# EAGLE design zero_board (EAGLE 6.4)
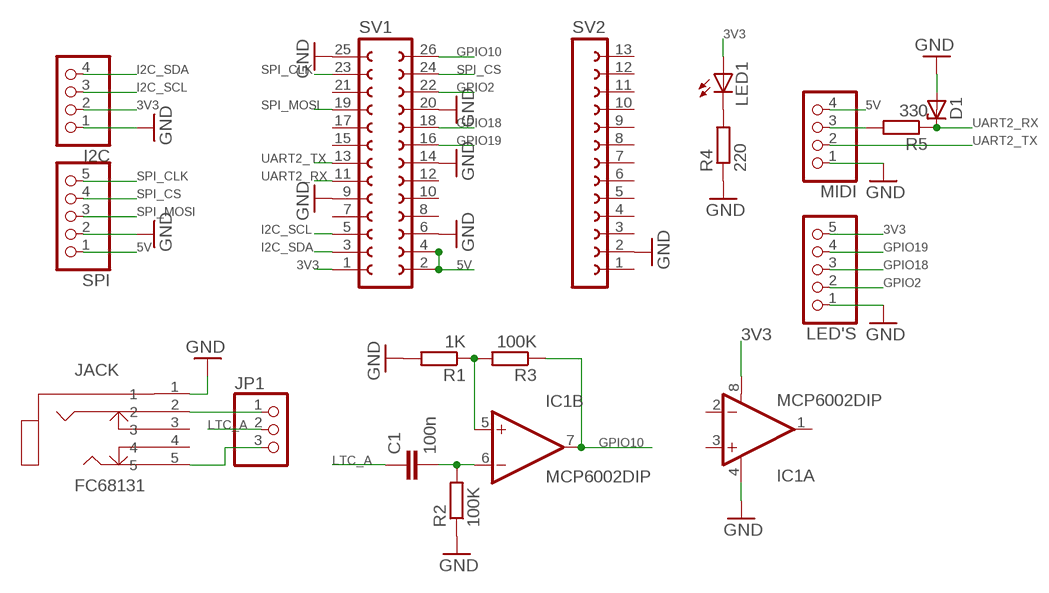
[diagram p0: schematic, sheet 1]

## Parts
C1  100n  C-EU050-024X044  [C050-024X044]
D1  ZENER-DIODEZD-2.5  [ZDIO-2.5]
I2C  PINHD-1X4  [1X04]
IC1  MCP6002DIP  [DIP08]
JACK  FC68131  [FC68131-5P]
JP1  PINHD-1X3  [1X03]
LED1  LED3MM  [LED3MM]
LED'S  PINHD-1X5  [1X05]
MIDI  PINHD-1X4  [1X04]
R1  1K  R-EU_0204/5  [0204/5]
R2  100K  R-EU_0204/5  [0204/5]
R3  100K  R-EU_0204/5  [0204/5]
R4  220  R-EU_0204/5  [0204/5]
R5  330  R-EU_0204/2V  [0204V]
SPI  PINHD-1X5  [1X05]
SV1  FE13-2  [FE13-2]
SV2  FE13-1  [FE13]

## Nets
3V3: I2C.2 IC1.8(A:V+) LED1.A LED'S.5 SV1.1
5V: MIDI.4 SPI.1 SV1.2 SV1.4
GND: D1.A I2C.1 IC1.4(A:V-) JACK.1 LED'S.1 MIDI.1 R1.2 R2.1 R4.1 SPI.2 SV1.6 SV1.9 SV1.14 SV1.20 SV1.25 SV2.2
GPIO2: LED'S.2 SV1.22
GPIO10: IC1.7(B:OUT) R3.1 SV1.26
GPIO18: LED'S.3 SV1.18
GPIO19: LED'S.4 SV1.16
I2C_SCL: I2C.3 SV1.5
I2C_SDA: I2C.4 SV1.3
LTC_A: C1.1 JP1.2
N$1: LED1.K(C) R4.2
N$2: JACK.5 JP1.3
N$3: JACK.2 JP1.1
N$5: C1.2 IC1.6(B:-IN) R2.2
N$6: IC1.5(B:+IN) R1.1 R3.2
N$7: MIDI.3 R5.2
SPI_CLK: SPI.5 SV1.23
SPI_CS: SPI.4 SV1.24
SPI_MOSI: SPI.3 SV1.19
UART2_RX: D1.C R5.1 SV1.11
UART2_TX: MIDI.2 SV1.13
Unconnected: IC1.1(A:OUT) IC1.2(A:-IN) IC1.3(A:+IN) JACK.3 JACK.4 SV1.7 SV1.8 SV1.10 SV1.12 SV1.15 SV1.17 SV1.21 SV2.1 SV2.3 SV2.4 SV2.5 SV2.6 SV2.7 SV2.8 SV2.9 SV2.10 SV2.11 SV2.12 SV2.13

## Library data of the parts
C1 = rcl:C-EU: CAPACITOR, European symbol
D1 = diode:ZENER-DIODE: Z-Diode
I2C MIDI = pinhead:PINHD-1X4: PIN HEADER
IC1 = MCP6002:MCP6002: 1 MHz, Low-Power Op Amp
JACK = con-cliff:FC68131
JP1 = pinhead:PINHD-1X3: PIN HEADER
LED1 = led:LED: LED OSRAM: - CHIPLED LG R971, LG N971, LY N971, LG Q971, LY Q971, LO R971, LY R971 LH N974, LH R974 LS Q976, LO Q976, LY Q976 LO Q996 - Hyper CHIPLED LW Q18S LB Q993, LB Q99A, LB R99A - SideLED LS A670, LO A670, LY A670, LG A670, LP A670 LB A673, LV A673, LT A673, LW A673 LH A674 LY A675 LS A676, LA A676, LO A676, LY A676, LW A676 LS A679, LY A679, LG A679 - Hyper Micro SIDELED® LS Y876, LA Y876, LO Y876, LY Y876 LT Y87S - SmartLED LW L88C, LW L88S LB L89C, LB L89S, LG L890 LS L89K, LO L89K, LY L89K LS L896, LA L896, LO L896, LY L896 - TOPLED LS T670, LO T670, LY T670, LG T670, LP T670 LSG T670, LSP T670, LSY T670, LOP T670, LYG T670 LG T671, LOG T671, LSG T671 LB T673, LV T673, LT T673, LW T673 LH T674 LS T676, LA T676, LO T676, LY T676, LB T676, LH T676, LSB T676, LW T676 LB T67C, LV T67C, LT T67C, LS T67K, LO T67K, LY T67K, LW E67C LS E67B, LA E67B, LO E67B, LY E67B, LB E67C, LV E67C, LT E67C LW T67C LS T679, LY T679, LG T679 LS T770, LO T770, LY T770, LG T770, LP T770 LB T773, LV T773, LT T773, LW T773 LH T774 LS E675, LA E675, LY E675, LS T675 LS T776, LA T776, LO T776, LY T776, LB T776 LHGB T686 LT T68C, LB T68C - Hyper Mini TOPLED® LB M676 - Mini TOPLED Santana® LG M470 LS M47K, LO M47K, LY M47K Source: http://www.osram.convergy.de LUXEON: - LUMILED® LXK2-PW12-R00, LXK2-PW12-S00, LXK2-PW14-U00, LXK2-PW14-V00 LXK2-PM12-R00, LXK2-PM12-S00, LXK2-PM14-U00 LXK2-PE12-Q00, LXK2-PE12-R00, LXK2-PE12-S00, LXK2-PE14-T00, LXK2-PE14-U00 LXK2-PB12-K00, LXK2-PB12-L00, LXK2-PB12-M00, LXK2-PB14-N00, LXK2-PB14-P00, LXK2-PB14-Q00 LXK2-PR12-L00, LXK2-PR12-M00, LXK2-PR14-Q00, LXK2-PR14-R00 LXK2-PD12-Q00, LXK2-PD12-R00, LXK2-PD12-S00 LXK2-PH12-R00, LXK2-PH12-S00 LXK2-PL12-P00, LXK2-PL12-Q00, LXK2-PL12-R00 Source: www.luxeon.com KINGBRIGHT: KA-3528ASYC Source: www.kingbright.com
LED'S SPI = pinhead:PINHD-1X5: PIN HEADER
R1-R5 = rcl:R-EU_: RESISTOR, European symbol
SV1 = con-lsta:FE13-2: FEMALE HEADER; OC_FARNELL: unknown; OC_NEWARK: unknown
SV2 = con-lsta:FE13-1: FEMALE HEADER; OC_FARNELL: unknown; OC_NEWARK: unknown

## Board
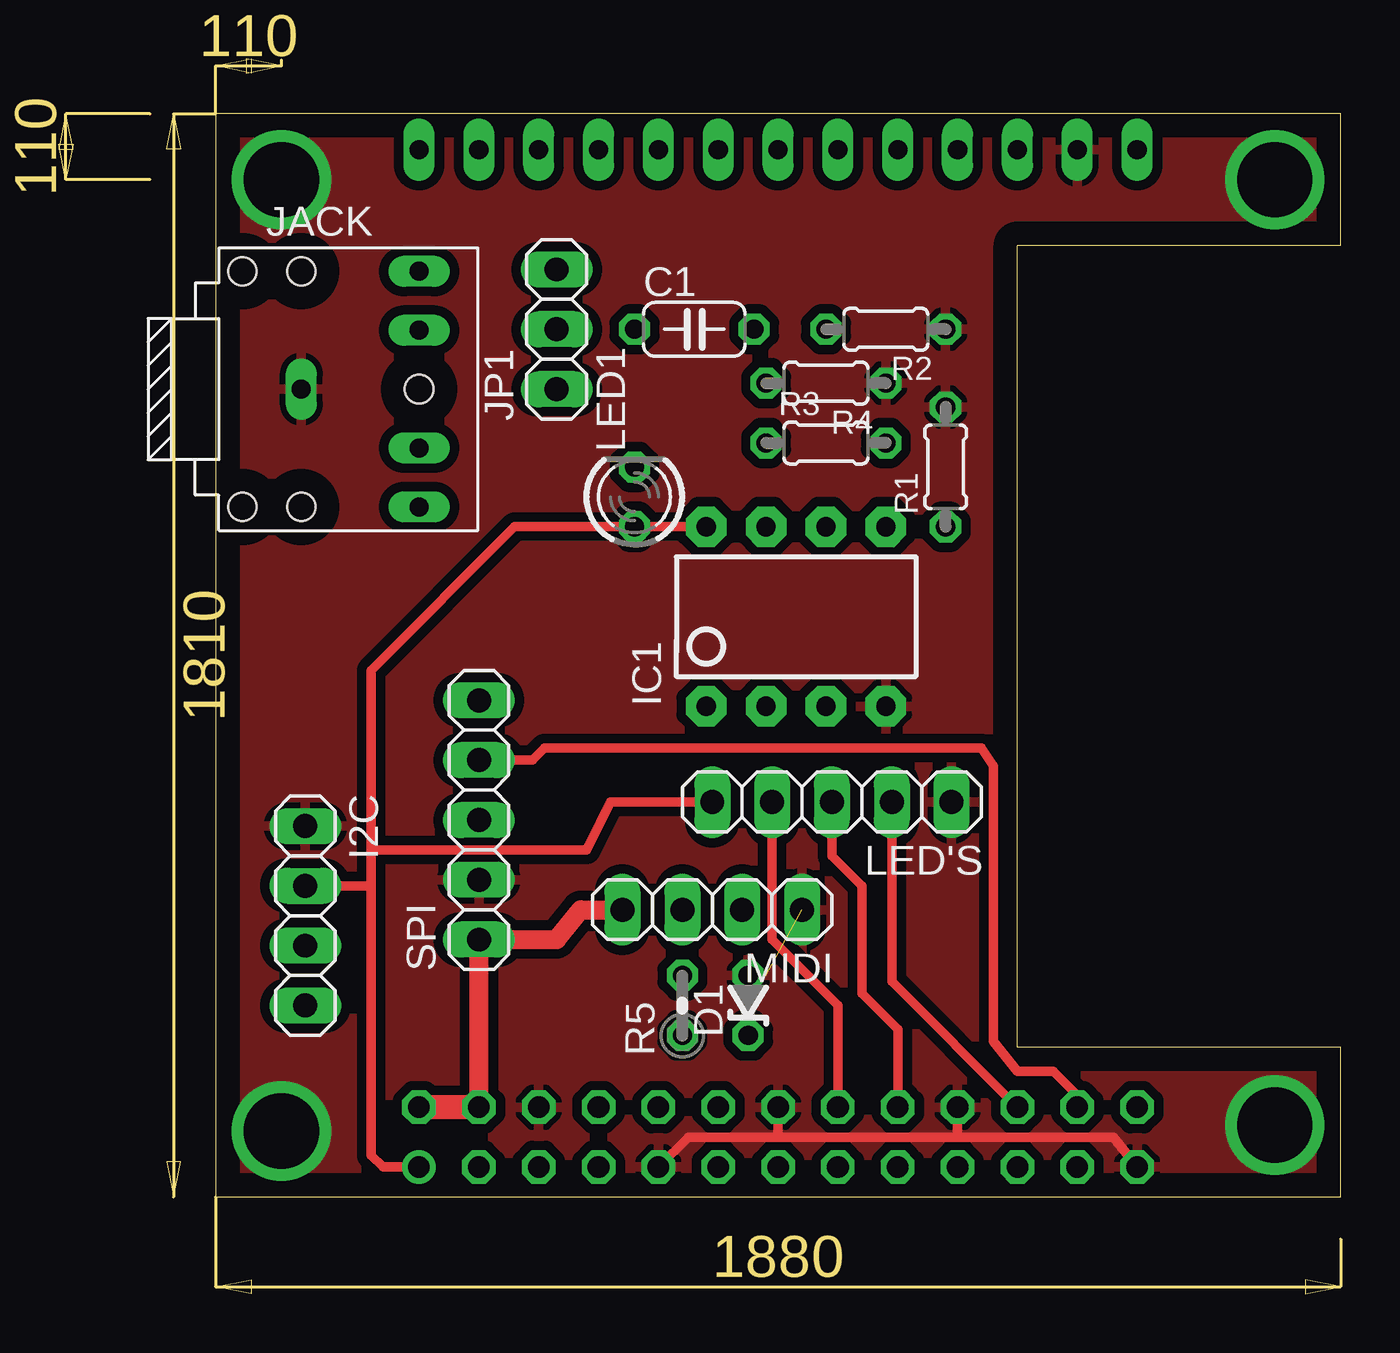
[diagram p1: board, top side]
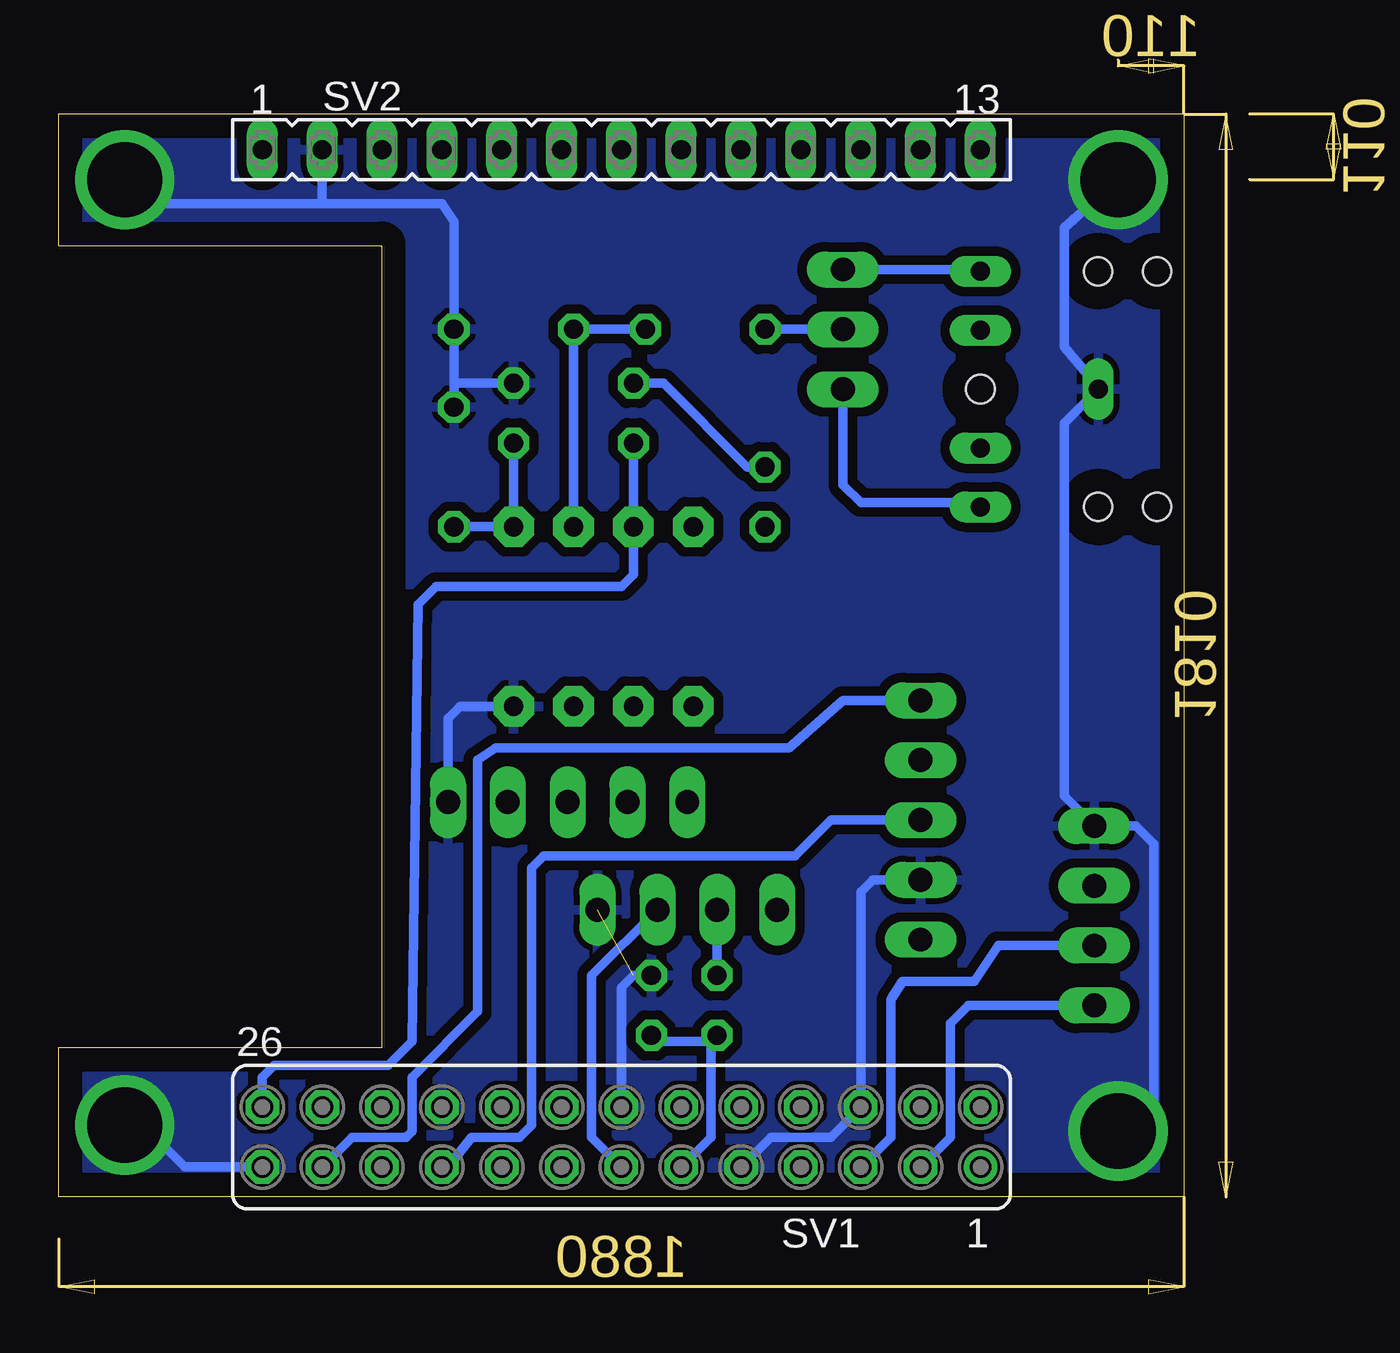
[diagram p2: board, bottom side, seen from below]

Size 47.75 x 45.97 mm. Coordinates in mm from the lower left corner, seen from the top.
Outline: 0,45.96 0,0 47.75,0 47.75,6.35 34.04,6.35 34.04,40.39 47.75,40.39 47.75,45.97 0,45.97
Copper layers (1*16): Top 0.035mm / dielectric 1.5mm / Bottom 0.035mm
Design rules "default": minimum track width 10mil, minimum drill 24mil, track to track 8mil, track to pad 8mil, pad to pad 8mil, via to via 8mil, smd to smd 8mil, copper to edge 40mil, drill to drill 8mil, minimum pad ring 10mil, minimum via ring 8mil, stop-mask expansion 4mil, vias tented up to drill 0mil, thermal gap 10mil

### Footprints (pad centres in the part's own frame; a part is rotated, then mirrored left to right if it is on the bottom)
C050-024X044 = drill 0.813 octagon: 1 -2.54,0; 2 2.54,0
ZDIO-2.5 = drill 0.813 octagon: A 1.27,0; C -1.27,0
1X04 = drill 1.016 long: 1 -3.81,0; 2 -1.27,0; 3 1.27,0; 4 3.81,0
DIP08 = drill 0.813 pad 1.727 octagon: 1 -3.81,-3.81; 2 -1.27,-3.81; 3 1.27,-3.81; 4 3.81,-3.81; 5 3.81,3.81; 6 1.27,3.81; 7 -1.27,3.81; 8 -3.81,3.81
FC68131-5P = drill 0.8 long: 1 -5,0; 2 0,-5; 3 0,-2.5; 4 0,2.5; 5 0,5 | hole 1.2: 0,0; -5,-5; -5,5; -7.5,5; -7.5,-5
1X03 = drill 1.016 long: 1 -2.54,0; 2 0,0; 3 2.54,0
LED3MM = drill 0.813 octagon: A -1.27,0; K 1.27,0
1X05 = drill 1.016 long: 1 -5.08,0; 2 -2.54,0; 3 0,0; 4 2.54,0; 5 5.08,0
0204/5 = drill 0.813 octagon: 1 -2.54,0; 2 2.54,0
0204V = drill 0.813 octagon: 1 -1.27,0; 2 1.27,0
FE13-2 = drill 0.914: 1 -15.24,1.27 | drill 0.914 octagon: 2 -15.24,-1.27; 3 -12.7,1.27; 4 -12.7,-1.27; 5 -10.16,1.27; 6 -10.16,-1.27; 7 -7.62,1.27; 8 -7.62,-1.27; 9 -5.08,1.27; 10 -5.08,-1.27; 11 -2.54,1.27; 12 -2.54,-1.27; 13 0,1.27; 14 0,-1.27; 15 2.54,1.27; 16 2.54,-1.27; 17 5.08,1.27; 18 5.08,-1.27; 19 7.62,1.27; 20 7.62,-1.27; 21 10.16,1.27; 22 10.16,-1.27; 23 12.7,1.27; 24 12.7,-1.27; 25 15.24,1.27; 26 15.24,-1.27
FE13 = drill 0.813 long: 1 -15.24,0; 2 -12.7,0; 3 -10.16,0; 4 -7.62,0; 5 -5.08,0; 6 -2.54,0; 7 0,0; 8 2.54,0; 9 5.08,0; 10 7.62,0; 11 10.16,0; 12 12.7,0; 13 15.24,0

### Placement (x,y rotation side)
C1  20.32,36.83 0 top
D1  22.61,8.13 90 top
I2C  3.81,11.94 270 top
IC1  24.64,24.64 0 top
JACK  8.64,34.29 0 top
JP1  14.48,36.83 90 top
LED1  17.78,29.72 90 top
LED'S  26.16,16.76 180 top
MIDI  21.08,12.19 180 top
R1  30.99,30.99 90 top
R2  28.45,36.83 180 top
R3  25.91,32 0 top
R4  25.91,34.54 180 top
R5  19.81,8.13 90 top
SPI  11.18,16 90 top
SV1  23.88,2.54 180 bottom
SV2  23.88,44.45 0 bottom

### Tracks (layer width: path | path; a pad name or v marks a point on that pad's centre or on a via)
3V3
  Top 0.406: SV1.1 7.11,1.27 6.6,1.78 6.6,13.21 | 6.6,13.21 I2C.2 | LED'S.5 16.76,16.76 15.75,14.73 6.6,14.73 | 6.6,14.73 6.6,13.21 | 6.6,14.73 6.6,22.35 12.7,28.45 LED1.A IC1.8
5V
  Top 0.813: SV1.4 SPI.1 14.48,10.92 15.49,12.19 MIDI.4
  Top 1.016: SV1.4 SV1.2
GND  (via drill 3.2)  (1 unrouted)
  Top 0.406: SV1.25 38.1,2.54 31.5,2.54 | 31.5,2.54 SV1.20 | SV1.14 23.88,2.54 | 23.88,2.54 31.5,2.54 | SV1.9 20.07,2.54 23.88,2.54
  Bottom 0.406: v44.96,3.05 44.2,3.05 42.42,1.27 SV1.25 | v44.96,43.18 44.2,43.18 43.18,42.16 36.58,42.16 | 1.52,4.06 v2.79,2.79 2.54,2.79 1.27,4.06 1.27,14.99 2.03,15.75 I2C.1 5.08,17.02 5.08,32.85 JACK.1 3.64,34.37 5.08,36.07 5.08,41.15 v2.79,43.18 | SV2.2 36.58,42.16 | 36.58,42.16 31.5,42.16 30.99,41.4 R2.1 30.99,34.54 | SPI.2 13.21,13.46 13.72,12.95 SV1.6 14.99,2.54 17.53,2.54 SV1.9 | LED'S.1 31.24,20.32 30.73,20.83 IC1.4 | R4.1 30.99,34.54 | 30.99,34.54 R1.2 | D1.A 23.37,9.4 23.88,8.89 SV1.14
  pour Bottom (isolate 0.406): 47.75,0 -0.25,0 0,45.97 47.75,45.97 47.75,40.64 34.04,40.64 34.04,6.35 47.75,6.35
  pour Top (isolate 0.406): 47.75,0 47.75,6.35 34.04,6.35 34.04,40.39 47.75,40.39 47.75,45.97 0,45.97 0,0
GPIO2
  Top 0.406: SV1.22 28.7,9.14 LED'S.2
GPIO10
  Bottom 0.406: R3.1 IC1.7 23.37,26.42 23.88,25.91 31.75,25.91 32.51,25.15 32.77,6.6 33.78,5.59 38.61,5.59 39.12,5.08 SV1.26
GPIO18
  Top 0.406: SV1.18 28.96,7.11 27.43,8.64 27.43,13.21 26.16,14.48 LED'S.3
GPIO19
  Top 0.406: LED'S.4 23.62,10.92 26.42,8.13 SV1.16
I2C_SCL
  Bottom 0.406: SV1.5 12.45,2.54 12.45,8.38 11.94,9.14 8.89,9.14 7.87,10.67 I2C.3
I2C_SDA
  Bottom 0.406: SV1.3 9.91,2.54 9.91,7.37 9.14,8.13 I2C.4
LTC_A
  Bottom 0.406: JP1.2 C1.1
N$1
  Bottom 0.406: LED1.K 18.54,30.99 22.1,34.54 R4.2
N$2
  Bottom 0.406: JP1.3 8.72,39.37 JACK.5
N$3
  Bottom 0.406: JACK.2 8.81,29.46 13.72,29.46 14.48,30.23 JP1.1
N$5
  Bottom 0.406: C1.2 R2.2 IC1.6
N$6
  Bottom 0.406: R1.1 IC1.5 R3.2
N$7
  Bottom 0.406: R5.2 MIDI.3
SPI_CLK
  Bottom 0.406: SV1.23 35.31,2.54 33.02,2.54 32.77,2.79 32.77,5.08 29.97,7.87 29.97,18.54 29.21,19.05 16.76,19.05 14.48,21.08 SPI.5
SPI_CS
  Top 0.406: SV1.24 36.58,4.32 35.56,5.33 34.04,5.33 33.02,6.6 33.02,18.29 32.51,19.05 13.97,19.05 13.46,18.54 SPI.4
SPI_MOSI
  Bottom 0.406: SV1.19 31.24,1.27 30.23,2.54 28.19,2.54 27.69,3.05 27.69,13.97 27.18,14.48 16.51,14.48 14.99,16 SPI.3
UART2_RX
  Bottom 0.406: SV1.11 20.07,2.54 20.07,6.6 | 20.07,6.6 R5.1 | 20.07,6.6 22.35,6.6 D1.C
UART2_TX
  Bottom 0.406: SV1.13 25.15,2.54 25.15,9.4 MIDI.2